# EAGLE design DACBRDV3 (EAGLE 5.07)
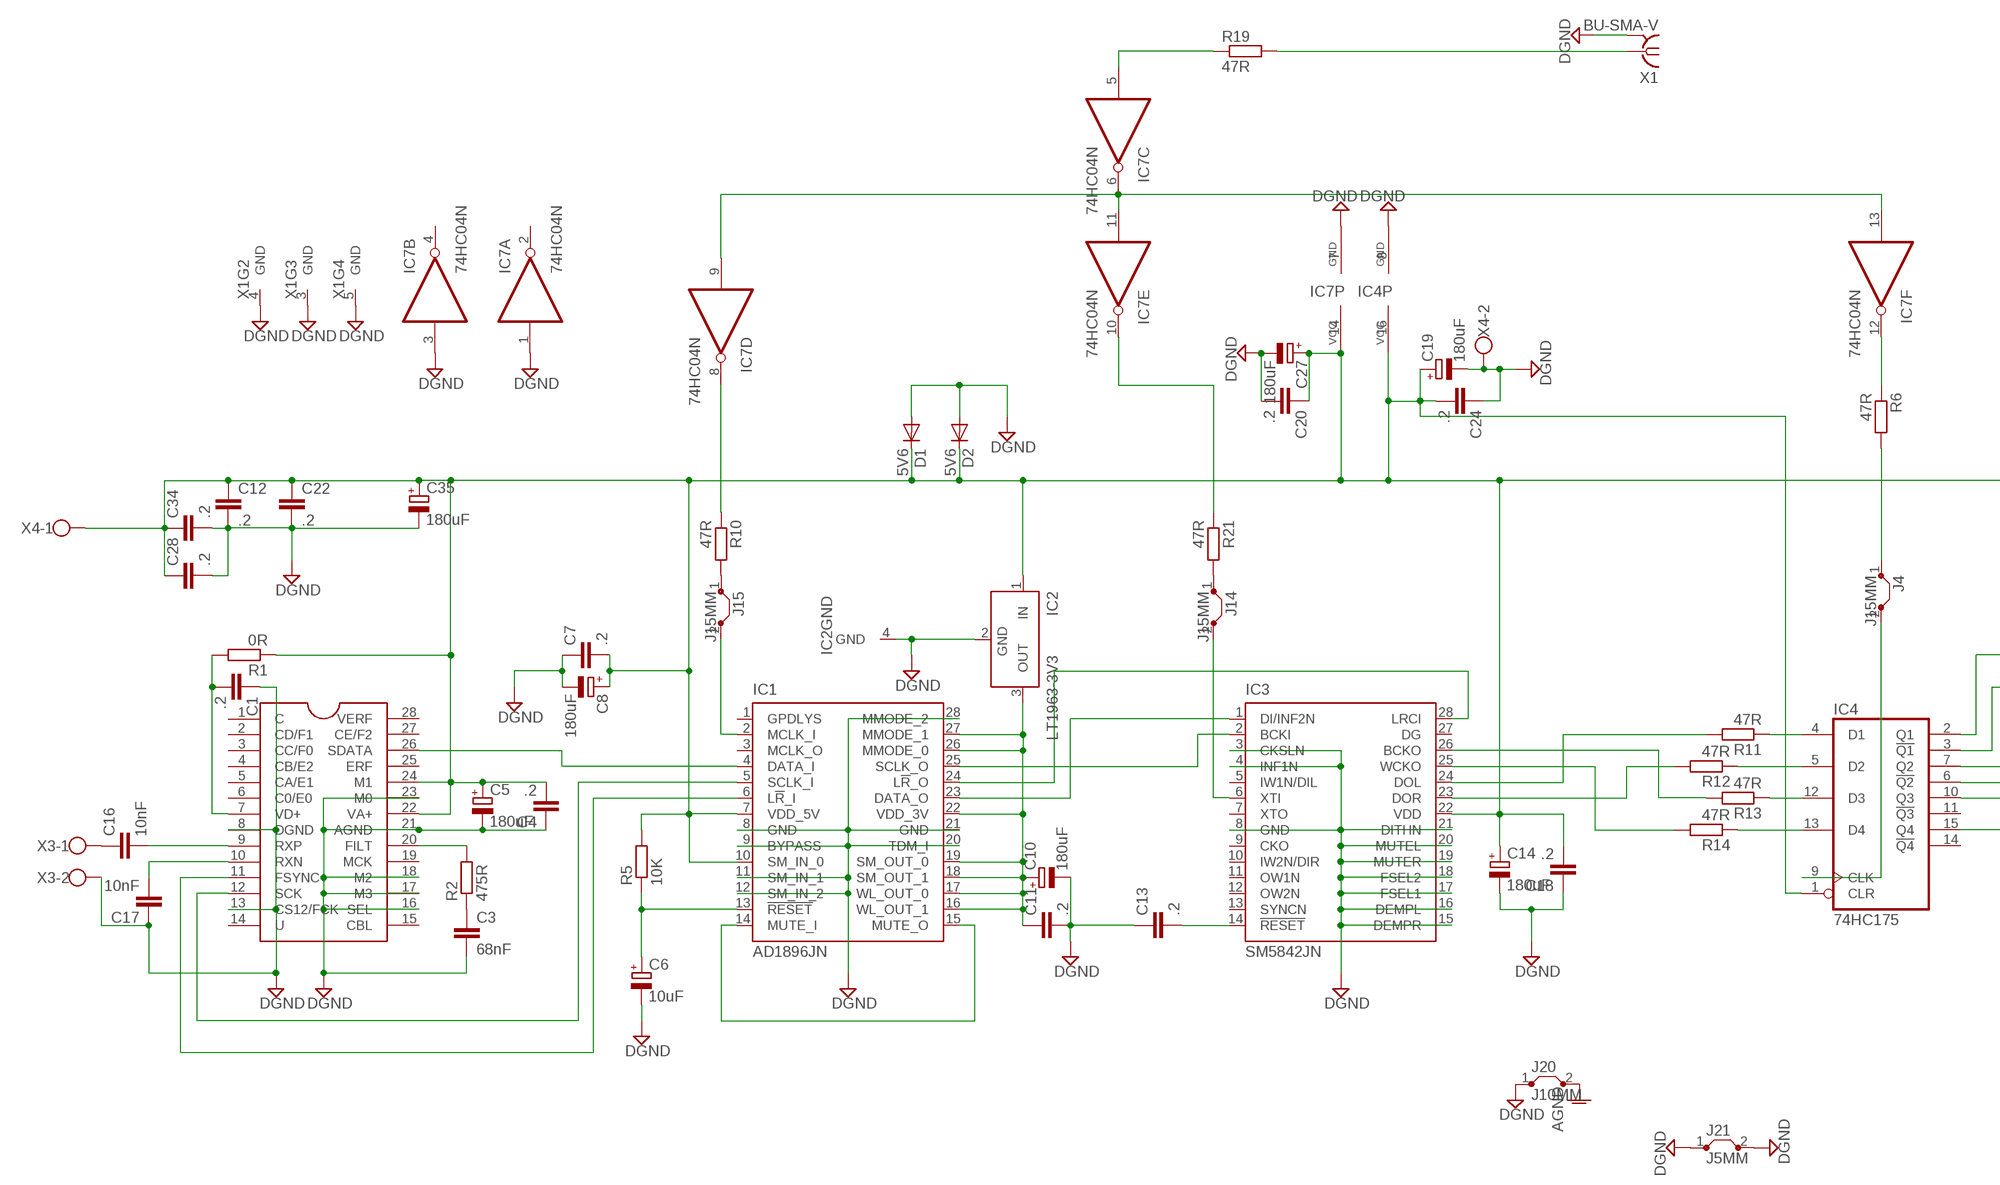
[diagram p0: schematic, sheet 1, part 1 of 2]
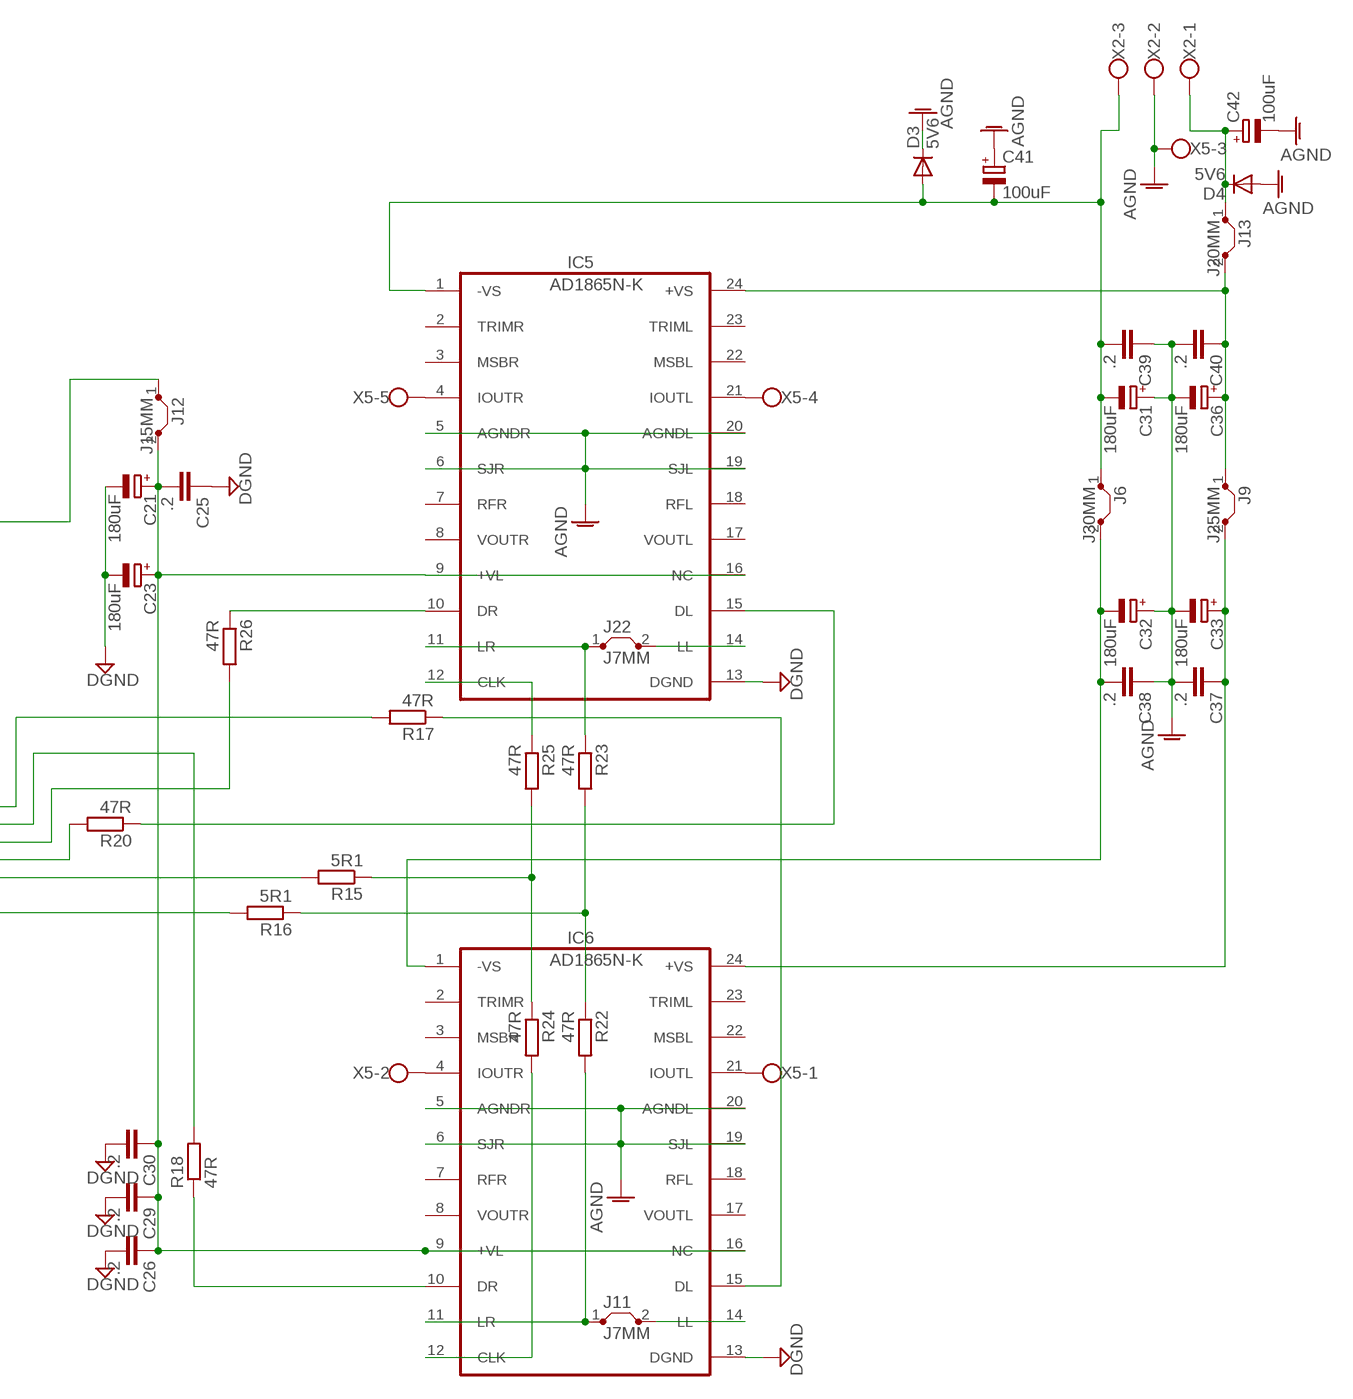
[diagram p1: schematic, sheet 1, part 2 of 2]

## Parts
C1  .2  C-EUC1210K  [C1210K]
C3  68nF  C-EU050-075X075  [C050-075X075]
C4  .2  C-EUC1210K  [C1210K]
C5  180uF  CPOL-EUE3.5-8  [E3,5-8]
C6  10uF  CPOL-EUE3.5-8  [E3,5-8]
C7  .2  C-EUC1210K  [C1210K]
C8  180uF  CPOL-EUE3.5-8  [E3,5-8]
C10  180uF  CPOL-EUE3.5-8  [E3,5-8]
C11  .2  C-EUC1210K  [C1210K]
C12  .2  C-EUC1210K  [C1210K]
C13  .2  C-EUC1210K  [C1210K]
C14  180uF  CPOL-EUE3.5-8  [E3,5-8]
C16  10nF  C-EU050-055X075  [C050-055X075]
C17  10nF  C-EU050-055X075  [C050-055X075]
C18  .2  C-EUC1210K  [C1210K]
C19  180uF  CPOL-EUE3.5-8  [E3,5-8]
C20  .2  C-EUC1210K  [C1210K]
C21  180uF  CPOL-EUE3.5-8  [E3,5-8]
C22  .2  C-EUC1210K  [C1210K]
C23  180uF  CPOL-EUE3.5-8  [E3,5-8]
C24  .2  C-EUC1210K  [C1210K]
C25  .2  C-EUC1210K  [C1210K]
C26  .2  C-EUC1210K  [C1210K]
C27  180uF  CPOL-EUE3.5-8  [E3,5-8]
C28  .2  C-EUC1210K  [C1210K]
C29  .2  C-EUC1210K  [C1210K]
C30  .2  C-EUC1210K  [C1210K]
C31  180uF  CPOL-EUE3.5-8  [E3,5-8]
C32  180uF  CPOL-EUE3.5-8  [E3,5-8]
C33  180uF  CPOL-EUE3.5-8  [E3,5-8]
C34  .2  C-EUC1210K  [C1210K]
C35  180uF  CPOL-EUE3.5-8  [E3,5-8]
C36  180uF  CPOL-EUE3.5-8  [E3,5-8]
C37  .2  C-EUC1210K  [C1210K]
C38  .2  C-EUC1210K  [C1210K]
C39  .2  C-EUC1210K  [C1210K]
C40  .2  C-EUC1210K  [C1210K]
C41  100uF  CPOL-EUE5-10.5  [E5-10,5]
C42  100uF  CPOL-EUE5-10.5  [E5-10,5]
D1  5V6  A114  [DO204-10]
D2  5V6  A114  [DO204-10]
D3  5V6  A114  [DO204-10]
D4  5V6  A114  [DO204-10]
IC1  AD1896JN  [DIL28-6]
IC2  LT1963-3V3  LT1129CST5  [SOT223]
IC3  SM5842JN  [DIL28-6]
IC4  74HC175  74175N  [DIL16]
IC5  AD1865N-K  AD1865  [DIL24-6]
IC6  AD1865N-K  AD1865  [DIL24-6]
IC7  74HC04N  7404N  [DIL14]
J4  J15MM  [15]
J6  J30MM  [30]
J9  J25MM  [25]
J11  J7MM  [07]
J12  J15MM  [15]
J13  J20MM  [20]
J14  J15MM  [15]
J15  J15MM  [15]
J20  J10MM  [10]
J21  J5MM  [05]
J22  J7MM  [07]
R1  0R  R-EU_M5923  [M5923]
R2  475R  R-EU_0204/7  [0204/7]
R5  10K  R-EU_0204/7  [0204/7]
R6  47R  R-EU_0207/12  [0207/12]
R10  47R  R-EU_0204/7  [0204/7]
R11  47R  R-EU_0204/7  [0204/7]
R12  47R  R-EU_0207/10  [0207/10]
R13  47R  R-EU_0204/7  [0204/7]
R14  47R  R-EU_0204/7  [0204/7]
R15  5R1  R-EU_0204/7  [0204/7]
R16  5R1  R-EU_0204/7  [0204/7]
R17  47R  R-EU_0207/10  [0207/10]
R18  47R  R-EU_0207/10  [0207/10]
R19  47R  R-EU_0207/10  [0207/10]
R20  47R  R-EU_0207/12  [0207/12]
R21  47R  R-EU_0204/7  [0204/7]
R22  47R  R-EU_0207/12  [0207/12]
R23  47R  R-EU_0207/15  [0207/15]
R24  47R  R-EU_0207/12  [0207/12]
R25  47R  R-EU_0207/15  [0207/15]
R26  47R  R-EU_0207/12  [0207/12]
U$1  CS8414  CS8414DIP  [DIL28]
X1  BU-SMA-V  [BU-SMA-V]
X2  W237-03P  [W237-133]
X3  W237-02P  [W237-132]
X4  W237-02P  [W237-132]
X5  W237-05P  [W237-5P]

## Nets
AGND: C31.+ C32.+ C33.- C36.- C37.2 C38.1 C39.1 C40.2 C41.+ C42.- D3.C D4.A IC5.5(AGNDR) IC5.6(SJR) IC5.19(SJL) IC5.20(AGNDL) IC6.5(AGNDR) IC6.6(SJR) IC6.19(SJL) IC6.20(AGNDL) J20.2 X2.2 X5.3
DGND: C1.1 C3.2 C4.1 C5.- C6.- C7.1 C8.- C10.- C11.2 C12.2 C13.1 C14.- C17.1 C18.1 C19.- C20.2 C21.- C22.2 C23.- C24.1 C25.1 C26.2 C27.- C28.2 C29.2 C30.2 C34.2 C35.- D1.A D2.A IC1.8(GND) IC1.9(BYPASS) IC1.11(SM_IN_1) IC1.12(SM_IN_2) IC1.20(TDM_I) IC1.21(GND) IC1.28(MMODE_2) IC2.2(GND) IC2.4(GND) IC3.3(CKSLN) IC3.4(INF1N) IC3.8(GND) IC3.15(DEMPR) IC3.16(DEMPL) IC3.17(FSEL1) IC3.18(FSEL2) IC3.19(MUTER) IC3.20(MUTEL) IC3.21(DITHN) IC4.8(GND) IC5.13(DGND) IC6.13(DGND) IC7.1(A:I) IC7.3(B:I) IC7.7(P:GND) J20.1 J21.1 J21.2 U$1.8(DGND) U$1.13(CS12/FCK) U$1.16(SEL) U$1.17(M3) U$1.18(M2) U$1.21(AGND) U$1.23(M0) X1.2(GND) X1.3(GND) X1.4(GND) X1.5(GND) X3.2 X4.2
N$1: R2.2 U$1.20(FILT)
N$2: IC1.14(MUTE_I) IC1.15(MUTE_O)
N$3: C3.1 R2.1
N$5: C1.2 R1.2 U$1.7(VD+)
N$7: C4.2 C5.+ C7.2 C8.+ C12.1 C14.+ C18.2 C19.+ C20.1 C22.1 C24.2 C27.+ C28.1 C34.1 C35.+ D1.C D2.C IC1.7(VDD_5V) IC1.10(SM_IN_0) IC2.1(IN) IC3.22(VDD) IC4.1(CLR) IC4.16(VCC) IC7.14(P:VCC) J12.1 R1.1 R5.2 U$1.22(VA+) U$1.24(M1) X4.1
N$8: C10.+ C11.1 IC1.16(WL_OUT_1) IC1.17(WL_OUT_0) IC1.18(SM_OUT_1) IC1.19(SM_OUT_0) IC1.22(VDD_3V) IC1.26(MMODE_0) IC1.27(MMODE_1) IC2.3(OUT)
N$10: C6.+ IC1.13(!RESET) R5.1
N$12: IC1.2(MCLK_I) J15.2
N$14: IC7.8(D:O) R10.1
N$15: IC7.12(F:O) R6.1
N$17: IC3.6(XTI) J14.2
N$19: IC1.4(DATA_I) U$1.26(SDATA)
N$21: IC1.23(DATA_O) IC3.1(DI/INF2N)
N$22: IC1.25(SCLK_O) IC3.2(BCKI)
N$23: C17.2 U$1.10(RXN)
N$24: C16.2 U$1.9(RXP)
N$25: C16.1 X3.1
N$26: IC1.24(L!R!_O) IC3.28(LRCI)
N$28: IC7.10(E:O) R21.1
N$29: C13.2 IC3.14(!RESET)
N$31: IC3.26(BCKO) R13.2
N$33: IC1.6(L!R!_I) U$1.11(FSYNC)
N$34: IC1.5(SCLK_I) U$1.12(SCK)
N$36: IC3.24(DOL) R11.2
N$37: IC3.23(DOR) R12.2
N$38: IC4.4(D1) R11.1
N$40: IC4.5(D2) R12.1
N$41: IC4.12(D3) R13.1
N$44: IC4.13(D4) R14.1
N$45: IC3.25(WCKO) R14.2
N$47: IC4.10(Q3) R15.2
N$48: IC4.15(Q4) R16.2
N$49: IC4.2(Q1) R17.2
N$50: IC4.3(!Q1) R18.2
N$51: IC5.10(DR) R26.1
N$52: IC4.6(!Q2) R20.2
N$53: IC4.9(CLK) J4.2
N$54: J4.1 R6.2
N$55: IC6.11(LR) J11.1 R22.2
N$56: IC5.11(LR) J22.1 R23.1
N$57: R16.1 R22.1 R23.2
N$58: R15.1 R24.1 R25.2
N$59: IC5.12(CLK) R25.1
N$60: IC6.12(CLK) R24.2
N$61: IC7.6(C:O) IC7.9(D:I) IC7.11(E:I) IC7.13(F:I)
N$62: C21.+ C23.+ C25.2 C26.1 C29.1 C30.1 IC5.9(+VL) IC5.16(NC) IC6.9(+VL) IC6.16(NC) J12.2
N$63: IC5.15(DL) R20.1
N$64: IC6.10(DR) R18.1
N$65: IC4.7(Q2) R26.2
N$66: IC6.15(DL) R17.1
N$67: J15.1 R10.2
N$68: IC6.14(LL) J11.2
N$69: IC7.5(C:I) R19.1
N$70: C32.- C38.2 IC6.1(-VS) J6.2
N$71: IC5.14(LL) J22.2
N$72: J14.1 R21.2
N$73: C33.+ C37.1 IC6.24(+VS) J9.2
N$74: C31.- C39.2 C41.- D3.A IC5.1(-VS) J6.1 X2.3
N$75: C36.+ C40.1 IC5.24(+VS) J9.1 J13.2
N$76: IC5.4(IOUTR) X5.5
N$77: C42.+ D4.C J13.1 X2.1
N$78: IC5.21(IOUTL) X5.4
N$79: IC6.21(IOUTL) X5.1
N$80: IC6.4(IOUTR) X5.2
N$83: R19.2 X1.1
Unconnected: IC1.1(GPDLYS) IC1.3(MCLK_O) IC3.5(IW1N/DIL) IC3.7(XTO) IC3.9(CKO) IC3.10(IW2N/DIR) IC3.11(OW1N) IC3.12(OW2N) IC3.13(SYNCN) IC3.27(DG) IC4.11(!Q3) IC4.14(!Q4) IC5.2(TRIMR) IC5.3(MSBR) IC5.7(RFR) IC5.8(VOUTR) IC5.17(VOUTL) IC5.18(RFL) IC5.22(MSBL) IC5.23(TRIML) IC6.2(TRIMR) IC6.3(MSBR) IC6.7(RFR) IC6.8(VOUTR) IC6.17(VOUTL) IC6.18(RFL) IC6.22(MSBL) IC6.23(TRIML) IC7.2(A:O) IC7.4(B:O) U$1.1(C) U$1.2(CD/F1) U$1.3(CC/F0) U$1.4(CB/E2) U$1.5(CA/E1) U$1.6(C0/E0) U$1.14(U) U$1.15(CBL) U$1.19(MCK) U$1.25(ERF) U$1.27(CE/F2) U$1.28(VERF)

## Library data of the parts
C1 C3 C4 C7 C11-C13 C16-C18 C20 C22 C24-C26 C28-C30 C34 C37-C40 = resistor:C-EU: CAPACITOR, European symbol
C5 C6 C8 C10 C14 C19 C21 C23 C27 C31-C33 C35 C36 C41 C42 = resistor:CPOL-EU: POLARIZED CAPACITOR, European symbol
D1-D4 = diode:A114: DIODE germanium
IC1 = analog-devices:AD1896: Stereo Asynchronous Sample Rate Converter Auto generated by make-symbol-device-package-bsdl.ulp Rev. 33 Source: http://www.analog.com/static/imported-files/data_sheets/AD1896.pdf
IC2 = linear-technology:LT1129CST5: VOLTAGE REGULATOR with shutdown
IC3 = analog-devices:SM5842: High-Class Audio Multi-function Digital Filter Source: http://www.dddac.de/files/SM5842.pdf
IC4 = 74xx-us:74*175: Qadruple D type FLIP FLOP, clear
IC5 IC6 = pavouk:AD1865: Complete Dual 18-Bit 16xFS Audio DAC
IC7 = 74xx-us:74*04: Hex INVERTER
J4 J6 J9 J11-J15 J20-J22 = jumper:J: Bridge
R1 R2 R5 R6 R10-R26 = resistor:R-EU_: RESISTOR, European symbol
U$1 = cirrus-dar:CS8414: 24bit 96kHz Digital Audio Receiver
X1 = con-coax:BU-SMA-V: FEMALE SMA CONNECTOR Radiall distributor RS 112-3794
X2 = con-wago-508:W237-03P: WAGO SREW CLAMP
X3 X4 = con-wago-508:W237-02P: WAGO SREW CLAMP
X5 = con-wago-508:W237-05P: WAGO SREW CLAMP

## Board
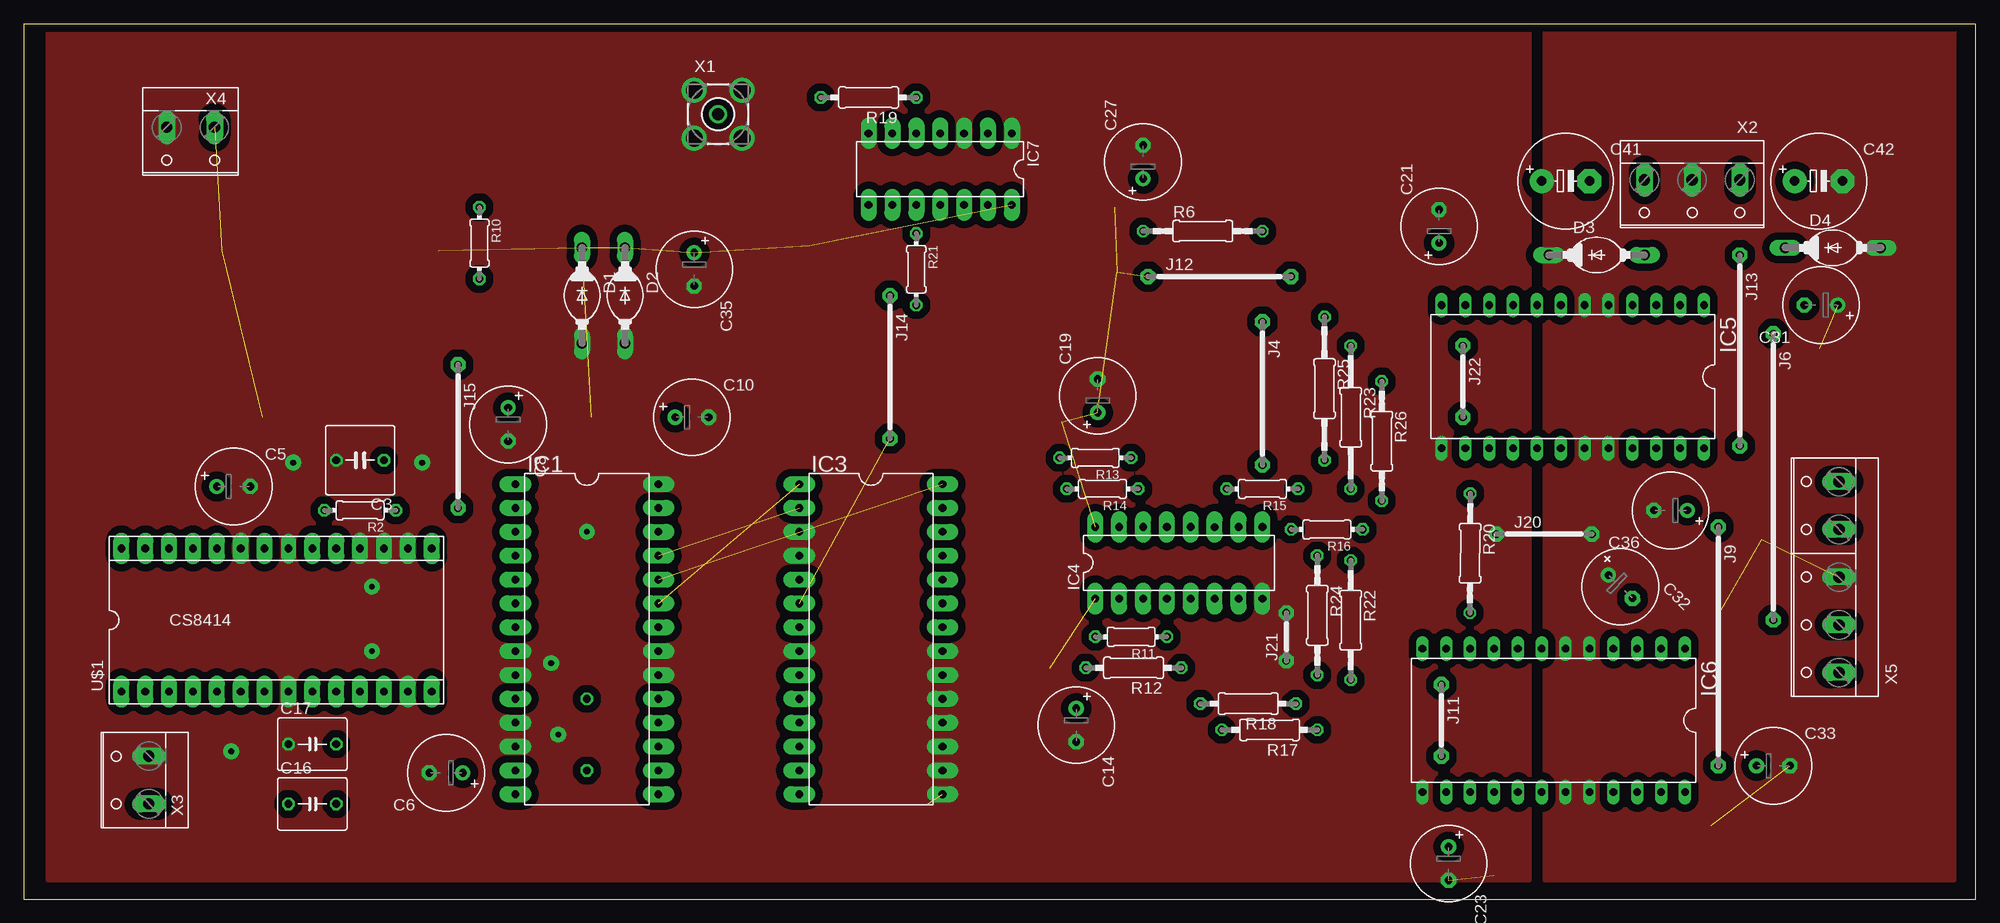
[diagram p2: board, top side]
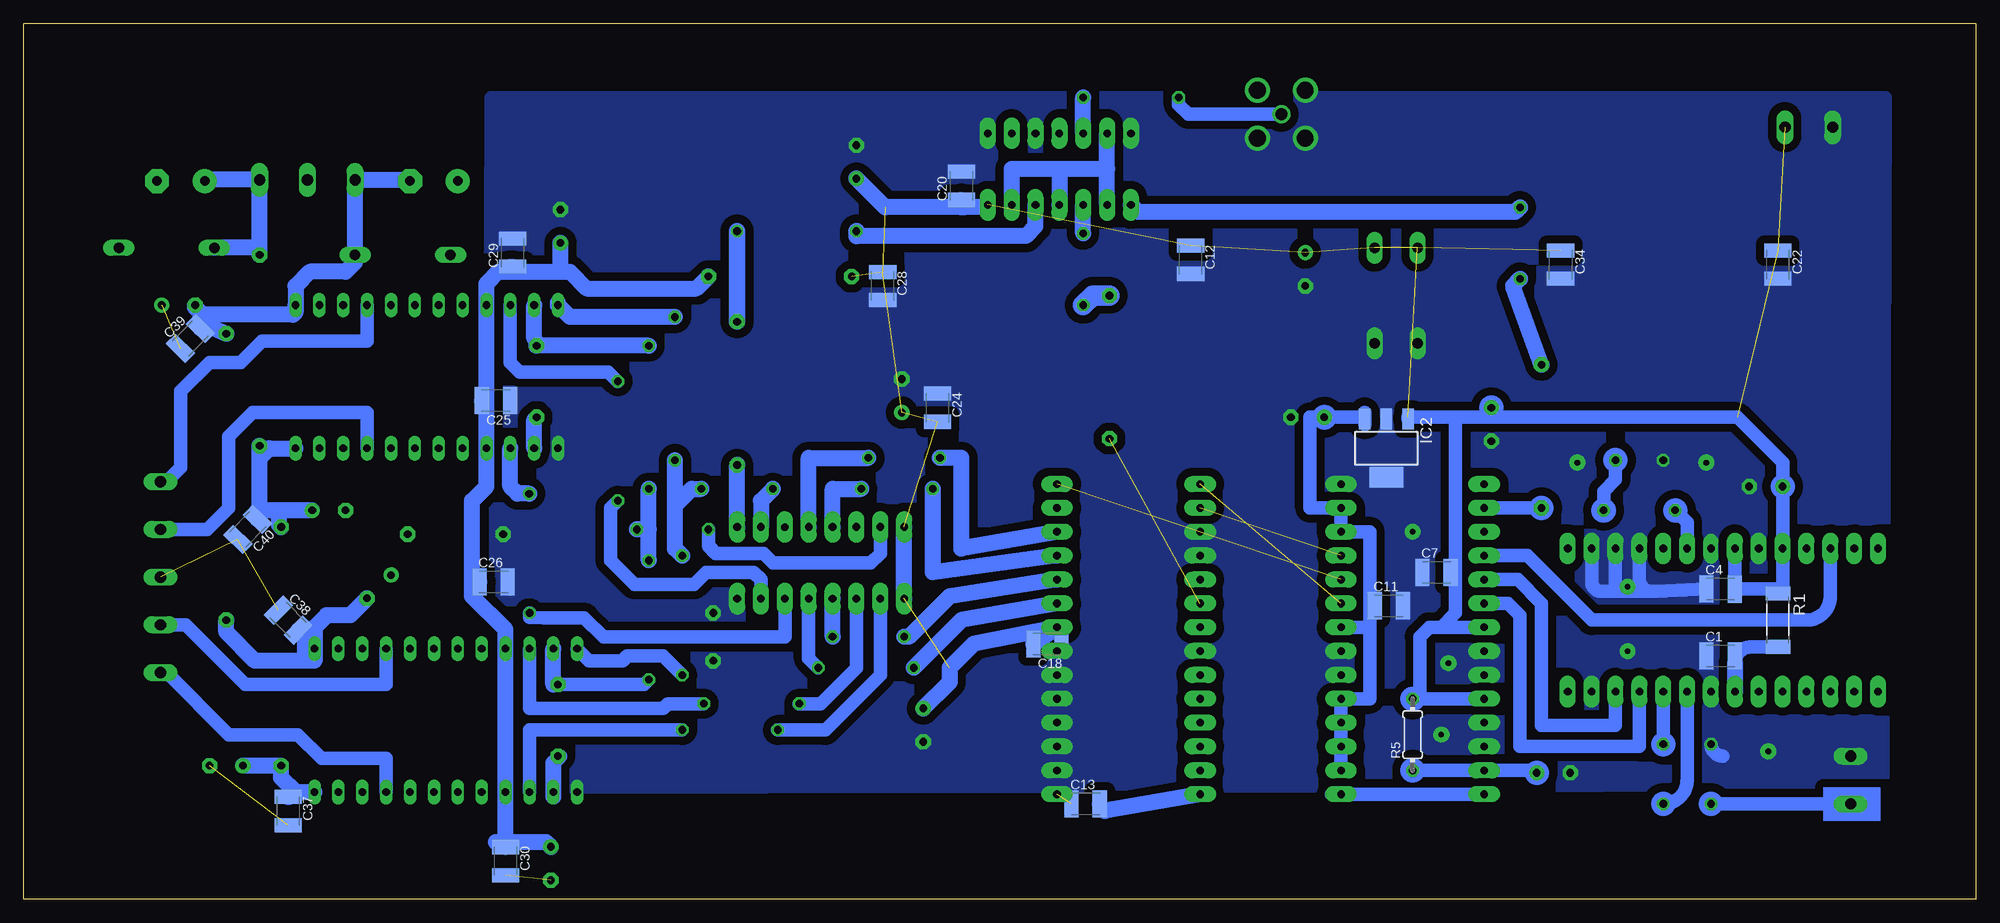
[diagram p3: board, bottom side, seen from below]

Size 207.75 x 93.22 mm. Coordinates in mm from the lower left corner, seen from the top.
Outline: 207.75,93.22 207.75,0 0,0 0,93.22 207.75,93.22
Copper layers (1*16): Top 0.035mm / dielectric 1.5mm / Bottom 0.035mm
Design rules "default *": minimum track width 10mil, minimum drill 24mil, track to track 8mil, track to pad 8mil, pad to pad 8mil, via to via 8mil, smd to smd 8mil, copper to edge 30mil, drill to drill 8mil, minimum pad ring 10mil, minimum via ring 8mil, stop-mask expansion 4mil, vias tented up to drill 0mil, thermal gap 10mil

### Footprints (pad centres in the part's own frame; a part is rotated, then mirrored left to right if it is on the bottom)
C1210K = smd 1.5 x 2.9: 1 -1.5,0; 2 1.5,0
C050-075X075 = drill 0.813 octagon: 1 -2.54,0; 2 2.54,0
E3,5-8 = drill 0.813 pad 1.6 round: + -1.778,0 | drill 0.813 pad 1.6 octagon: - 1.778,0
C050-055X075 = drill 0.813 octagon: 1 -2.54,0; 2 2.54,0
E5-10,5 = drill 1.016 pad 2.54 round: + -2.54,0 | drill 1.016 pad 2.54 octagon: - 2.54,0
DO204-10 = drill 1.118 long: A 5.08,0; C -5.08,0
DIL28-6 = drill 0.813 pad 1.676 long: 1 -16.51,-7.62; 2 -13.97,-7.62; 3 -11.43,-7.62; 4 -8.89,-7.62; 5 -6.35,-7.62; 6 -3.81,-7.62; 7 -1.27,-7.62; 8 1.27,-7.62; 9 3.81,-7.62; 10 6.35,-7.62; 11 8.89,-7.62; 12 11.43,-7.62; 13 13.97,-7.62; 14 16.51,-7.62; 15 16.51,7.62; 16 13.97,7.62; 17 11.43,7.62; 18 8.89,7.62; 19 6.35,7.62; 20 3.81,7.62; 21 1.27,7.62; 22 -1.27,7.62; 23 -3.81,7.62; 24 -6.35,7.62; 25 -8.89,7.62; 26 -11.43,7.62; 27 -13.97,7.62; 28 -16.51,7.62
SOT223 = smd 1.219 x 2.235: 1 -2.311,-3.099; 2 0,-3.099; 3 2.311,-3.099 | smd 3.6 x 2.2: 4 0,3.099
DIL16 = drill 0.813 pad 1.676 long: 1 -8.89,-3.81; 2 -6.35,-3.81; 3 -3.81,-3.81; 4 -1.27,-3.81; 5 1.27,-3.81; 6 3.81,-3.81; 7 6.35,-3.81; 8 8.89,-3.81; 9 8.89,3.81; 10 6.35,3.81; 12 1.27,3.81; 13 -1.27,3.81; 14 -3.81,3.81; 15 -6.35,3.81; 16 -8.89,3.81 | drill 0.8 pad 1.676 long: 11 3.81,3.81
DIL24-6 = drill 0.813 long: 1 -13.97,-7.62; 2 -11.43,-7.62; 3 -8.89,-7.62; 4 -6.35,-7.62; 5 -3.81,-7.62; 6 -1.27,-7.62; 7 1.27,-7.62; 8 3.81,-7.62; 9 6.35,-7.62; 10 8.89,-7.62; 11 11.43,-7.62; 12 13.97,-7.62; 13 13.97,7.62; 14 11.43,7.62; 15 8.89,7.62; 16 6.35,7.62; 17 3.81,7.62; 18 1.27,7.62; 19 -1.27,7.62; 20 -3.81,7.62; 21 -6.35,7.62; 22 -8.89,7.62; 23 -11.43,7.62; 24 -13.97,7.62
DIL14 = drill 0.813 pad 1.676 long: 1 -7.62,-3.81; 2 -5.08,-3.81; 3 -2.54,-3.81; 4 0,-3.81; 5 2.54,-3.81; 6 5.08,-3.81; 7 7.62,-3.81; 8 7.62,3.81; 9 5.08,3.81; 10 2.54,3.81; 11 0,3.81; 12 -2.54,3.81; 13 -5.08,3.81; 14 -7.62,3.81
15 = drill 0.813 pad 1.6 octagon: 1 -7.62,0; 2 7.62,0
30 = drill 0.813 pad 1.6 octagon: 1 -15.24,0; 2 15.24,0
25 = drill 0.813 pad 1.6 octagon: 1 -12.7,0; 2 12.7,0
07 = drill 0.813 pad 1.6 octagon: 1 -3.81,0; 2 3.81,0
20 = drill 0.813 pad 1.6 octagon: 1 -10.16,0; 2 10.16,0
10 = drill 0.813 pad 1.6 octagon: 1 -5.08,0; 2 5.08,0
05 = drill 0.813 pad 1.6 octagon: 1 -2.54,0; 2 2.54,0
M5923 = smd 1.5 x 2.6: 1 -2.85,0; 2 2.85,0
0204/7 = drill 0.813 octagon: 1 -3.81,0; 2 3.81,0
0207/12 = drill 0.813 octagon: 1 -6.35,0; 2 6.35,0
0207/10 = drill 0.813 octagon: 1 -5.08,0; 2 5.08,0
0207/15 = drill 0.813 octagon: 1 -7.62,0; 2 7.62,0
DIL28 = drill 0.813 pad 1.676 long: 1 -16.51,-7.62; 2 -13.97,-7.62; 3 -11.43,-7.62; 4 -8.89,-7.62; 5 -6.35,-7.62; 6 -3.81,-7.62; 7 -1.27,-7.62; 8 1.27,-7.62; 9 3.81,-7.62; 10 6.35,-7.62; 11 8.89,-7.62; 12 11.43,-7.62; 13 13.97,-7.62; 14 16.51,-7.62; 15 16.51,7.62; 16 13.97,7.62; 17 11.43,7.62; 18 8.89,7.62; 19 6.35,7.62; 20 3.81,7.62; 22 -1.27,7.62; 23 -3.81,7.62; 24 -6.35,7.62; 25 -8.89,7.62; 26 -11.43,7.62; 27 -13.97,7.62; 28 -16.51,7.62 | drill 0.813 pad 1.6 long: 21 1.27,7.62
BU-SMA-V = drill 1.27 round: 1 0,0 | drill 1.778 round: 2 -2.55,2.55; 3 2.55,2.55; 4 2.55,-2.55; 5 -2.55,-2.55
W237-133 = drill 1.194 long: 1 -5.08,-0.635; 2 0,-0.635; 3 5.08,-0.635
W237-132 = drill 1.194 long: 1 -2.54,-0.635; 2 2.54,-0.635
W237-5P = drill 1.194 long: 1 -10.16,-0.635; 2 -5.08,-0.635; 3 0,-0.635; 4 5.08,-0.635; 5 10.16,-0.635

### Placement (x,y rotation side)
C1  27.18,25.91 0 bottom
C3  35.81,46.74 180 top
C4  27.18,33.02 359.9 bottom
C5  22.35,43.94 0 top
C6  44.96,13.46 180 top
C7  57.4,34.8 0 bottom
C8  51.56,50.55 270 top
C10  71.12,51.31 0 top
C11  62.48,31.24 0 bottom
C12  83.57,68.07 270 bottom
C13  94.74,10.16 0 bottom
C14  112.01,18.54 270 top
C16  30.73,10.16 0 top
C17  30.73,16.51 0 top
C18  98.81,27.18 180 bottom
C19  114.3,53.59 90 top
C20  107.95,75.95 90 bottom
C21  150.62,71.63 90 top
C22  21.08,67.56 270 bottom
C23  151.64,3.81 270 top
C24  110.49,52.32 270 bottom
C25  157.48,53.09 180 bottom
C26  157.73,33.78 359.9 bottom
C27  119.13,78.49 90 top
C28  116.33,65.28 270 bottom
C29  155.7,68.83 90 bottom
C30  156.46,4.06 270 bottom
C31  191.26,63.25 180.2 top
C32  169.93,33.27 316.1 top
C33  186.18,14.22 0 top
C34  44.2,67.56 270 bottom
C35  71.37,67.06 270 top
C36  175.26,41.4 180 top
C37  179.58,9.4 270 bottom
C38  179.58,29.72 315 bottom
C39  189.99,59.69 44.9 bottom
C40  183.9,39.37 226 bottom
C41  164.08,76.45 0 top
C42  191.01,76.45 0 top
D1  59.44,64.26 270 top
D2  64.01,64.26 270 top
D3  167.39,68.58 0 top
D4  192.53,69.34 0 top
IC1  59.94,27.69 270 top
IC2  62.74,48.01 180 bottom
IC3  90.17,27.69 270 top
IC4  122.94,35.81 0 top
IC5  164.85,55.63 180 top
IC6  162.81,19.05 180 top
IC7  97.54,77.72 180 top
J4  131.83,53.85 270 top
J6  186.18,44.96 270 top
J9  180.34,26.92 270 top
J11  150.88,19.05 270 top
J12  127.25,66.29 0 top
J13  182.63,58.42 270 top
J14  92.2,56.64 270 top
J15  46.23,49.28 270 top
J20  161.8,38.86 0 top
J21  134.37,27.94 90 top
J22  153.16,55.12 270 top
R1  21.08,29.72 270 bottom
R2  35.81,41.4 180 top
R5  59.94,17.53 90 bottom
R6  125.48,71.12 0 top
R10  48.51,69.85 270 top
R11  117.86,27.94 180 top
R12  118.11,24.64 180 top
R13  114.05,46.99 180 top
R14  114.81,43.69 180 top
R15  131.83,43.69 180 top
R16  138.68,39.37 180 top
R17  132.59,18.03 180 top
R18  130.3,20.83 180 top
R19  89.92,85.34 180 top
R20  153.92,36.83 269.8 top
R21  95,67.06 270 top
R22  141.22,29.72 270 top
R23  141.22,51.31 270 top
R24  137.67,30.23 270 top
R25  138.43,54.36 270 top
R26  144.53,48.77 270 top
U$1  26.92,29.72 0 top
X1  73.91,83.57 0 top
X2  177.55,75.95 180 top
X3  12.7,12.7 90 top
X4  17.78,81.53 180 top
X5  192.53,34.29 90 top

### Tracks (layer width: path | path; a pad name or v marks a point on that pad's centre or on a via)
AGND  (4 unrouted)
  pour Top (isolate 0.813, no thermals): 161.8,92.71 161.8,2.03 205.49,2.03 205.49,92.46
DGND  (via drill 0.6 pad 1.68)  (2 unrouted)
  Bottom 1.422: 26.92,15.24 arc90 C17.1 | C4.1 34.04,32.77 | 34.04,32.77 34.55,32.77 arc90 35.81,34.04 U$1.18 | U$1.17 38.35,33.27 arc-90 37.85,32.77 | 37.85,32.77 34.04,32.77 arc-90 34.04,32.77 | U$1.16 40.89,33.78 arc-90 39.88,32.77 37.85,32.77
  other vias: 37.08,33.27 37.08,26.42 22.1,15.75 56.13,25.15 56.9,17.53 59.94,39.12 28.7,46.48 42.42,46.48
  pour Top (isolate 0.813, no thermals): 2.54,92.2 2.54,2.03 160.27,2.03 160.27,92.2
  pour Bottom (isolate 0.889, no thermals): 9.65,85.34 9.91,12.19 158.24,11.94 157.99,85.34
N$1
  Bottom 1.422: R2.2 30.73,40.13 U$1.20
N$2
  Bottom 1.422: IC1.14 IC1.15 68.58,11.18
N$3
  Bottom 1.422: C3.1 38.35,44.7 39.62,43.43 R2.1
N$5
  Bottom 1.422: R1.2 23.93,26.87 arc-90 25.65,25.15 25.65,26.16 arc-90 25.65,26.42 C1.2
  Bottom 1.676: 25.65,25.15 U$1.7
N$7  (14 unrouted)
  Bottom 1.422: 21.08,33.02 20.57,33.02 U$1.24 C5.+ 20.57,46.48 25.4,51.31 51.56,51.31 | 21.08,33.02 C4.2 25.65,33.02 U$1.22 | R1.1 21.08,33.02 | 59.18,21.34 IC1.10 | 56.9,28.96 IC1.7 | 55.37,51.31 55.37,34.8 | 55.37,51.31 60.43,51.31 IC2.1 | 55.37,34.8 C7.2 | 51.56,51.31 55.37,51.31 | 51.56,51.31 C8.+ | 55.37,34.8 55.37,30.48 56.9,28.96 | 56.9,28.96 58.17,28.96 59.18,27.94 59.18,21.34 | 59.18,21.34 R5.2
  Bottom 1.676: IC4.1 IC4.16 | 107.95,73.66 C20.1 107.7,74.19 107.7,73.66 | IC7.14 105.41,73.66 107.7,73.66 | 107.7,73.66 107.95,73.66 | 107.95,73.66 116.08,73.66 C27.+ | C18.2 IC3.22 106.68,27.18 109.22,24.64 109.22,23.11 C14.+
N$8
  Bottom 1.422: IC1.16 IC1.17 IC1.18 IC1.19 64.52,21.34 64.52,28.96 | 64.52,28.96 IC1.22 | 64.52,31.47 64.52,39.12 IC1.26 IC1.27 70.87,41.66 70.87,51.31 C10.+ 65.02,51.31 | 65.02,51.31 65.02,50.55 | 65.02,51.31 65.02,51.82 65.05,51.82 IC2.3 | 64.52,31.47 C11.1 | 64.52,28.96 64.52,29.21 64.52,31.47
N$10
  Bottom 1.422: C6.+ 46.99,13.72 IC1.13 59.69,13.72 R5.1
N$12
  Bottom 1.422: J15.2 IC1.2
N$14
  Bottom 1.676: R10.1 49.02,73.15 89.15,73.15 IC7.8
N$15
  Bottom 1.676: IC7.12 100.08,71.63 101.09,70.61 119.13,70.61
  Bottom 1.778: 119.13,70.61 R6.1
N$17  (1 unrouted)
N$19
  Bottom 1.422: U$1.26 15.49,32.26 arc90 18.03,29.72 40.89,29.72 47.75,36.58 IC1.4
N$21  (1 unrouted)
N$22  (1 unrouted)
N$23
  Bottom 1.422: C17.2 U$1.10
N$24
  Bottom 1.422: U$1.9 30.73,12.7 arc90 C16.2
N$25
  Bottom 1.422: X3.1 C16.1
N$26  (1 unrouted)
N$28
  Bottom 1.676: R21.1 IC7.10
N$29
  Bottom 1.676: IC3.14 92.71,9.4 92.96,9.65 C13.2
N$31
  Bottom 1.676: IC3.26 107.95,37.34 107.95,46.99 R13.2
N$33
  Bottom 1.422: U$1.11 35.81,16.26 48.51,16.26 48.51,30.23 49.78,31.5 IC1.6
N$34
  Bottom 1.422: U$1.12 38.35,18.54 46.23,18.54 46.23,31.5 48.77,34.04 IC1.5
N$36
  Bottom 1.676: R11.2 113.54,27.94 109.22,32.26 IC3.24
N$37
  Bottom 1.676: IC3.23 107.95,29.72 R12.2
N$38
  Bottom 1.676: R11.1 IC4.4 121.67,32.77
N$40
  Bottom 1.422: IC4.5 124.21,25.65 R12.1
N$41
  Bottom 1.676: R13.1 124.21,46.99 IC4.12
N$44
  Bottom 1.676: R14.1 121.67,43.69 IC4.13
N$45
  Bottom 1.676: IC3.25 111,34.8 R14.2
N$47
  Bottom 1.676: R15.2 129.29,42.42 IC4.10
N$48
  Bottom 1.422: R16.2 134.87,37.59 134.11,36.83 129.03,36.83 128.02,35.81 117.6,35.81 116.59,36.83 IC4.15
N$49
  Bottom 1.422: IC4.2 116.59,23.88 122.43,18.03 R17.2
N$50
  Bottom 1.422: IC4.3 119.13,24.64 122.94,20.83 R18.2
N$51
  Bottom 1.422: R26.1 145.54,56.13 154.94,56.13 155.96,57.15 IC5.10
N$52
  Bottom 1.422: IC4.6 126.75,27.94 146.05,27.94 148.08,29.97 152.4,29.97 153.92,29.99 R20.2
N$53
  Bottom 1.676: IC4.9 J4.2
N$54
  Bottom 1.778: J4.1 R6.2
N$55
  Bottom 1.422: R22.2 141.73,22.86 J11.1 151.38,22.86
  Bottom 1.676: 151.38,22.86 IC6.11
N$56
  Bottom 1.422: J22.1 153.42,59.69
  Bottom 1.676: 153.42,59.69 IC5.11 | R23.1 J22.1
N$57
  Bottom 1.676: R22.1 141.22,39.37 | 141.22,39.37 R23.2 | 141.22,39.37 R16.1
N$58
  Bottom 1.676: R24.1 138.43,37.34 138.43,41.66 138.43,41.91 | 138.43,41.91 R25.2 | R15.1 136.65,43.69 138.43,41.91
N$59
  Bottom 1.676: 150.88,63.5 IC5.12 149.61,61.98 R25.1
N$60
  Bottom 1.422: R24.2 139.7,25.91 143.51,25.91 144.02,25.4 147.57,25.4 IC6.12
N$61
  Bottom 1.676: IC7.9 92.46,77.72 | IC7.13 102.62,77.72 97.54,77.72 | 92.46,77.72 97.54,77.72 | 97.54,77.72 IC7.11 | 92.46,77.72 IC7.6
N$62
  Bottom 1.676: 158.5,53.09 IC5.16 158.5,43.94 160.02,42.42 160.02,33.78 | 158.5,53.09 IC5.9 | IC5.9 | J12.2 136.14,65.02 147.83,65.02 149.61,66.8 150.62,66.8 | 155.96,66.8 157.23,66.8 158.5,65.53 IC5.9 | 155.96,66.8 150.62,66.8 | 150.62,66.8 C21.+ | 158.5,53.09 C25.2 | C29.1 155.96,67.33 155.96,66.8 | 160.02,33.78 160.02,32.26 156.46,28.7 IC6.9 IC6.16 156.46,6.1 | C26.1 160.02,33.78 | C23.+ 152.15,6.1 156.46,6.1 | 156.46,6.1 157.48,6.1 | 156.46,6.1 C30.1
N$63
  Bottom 1.676: R20.1 155.19,43.18 155.96,43.94 IC5.15
N$64
  Bottom 1.422: R18.1 139.19,20.83 139.7,20.32 153.92,20.32 IC6.10
N$65
  Bottom 1.422: IC4.7 129.29,34.04 130.05,34.8 135.13,34.8 136.4,33.53 142.75,33.53 145.29,36.07 145.29,41.66 R26.2
N$66
  Bottom 1.422: R17.1 153.92,18.03 IC6.15
N$67
  Bottom 1.676: R10.2 49.28,65.28 J15.1
N$68
  Bottom 1.422: 151.38,14.48 150.62,15.24 J11.2
  Bottom 1.676: 151.38,14.48 IC6.14 151.38,10.92
N$69
  Bottom 1.676: IC7.5 R19.1
N$70
  Bottom 1.676: J6.2 186.18,28.45 183.13,25.4 177.8,25.4 | 176.78,27.69 176.78,28.96 175.51,30.23 172.97,30.23 171.96,31.24 C32.- | 176.78,27.69 IC6.1 176.78,25.4 177.8,25.4 | 176.78,27.69 177.55,27.69 | C38.2 177.8,27.94 177.8,25.4
N$71
  Bottom 1.422: 153.42,51.05 J22.2
  Bottom 1.676: IC5.14 153.42,51.05
N$72
  Bottom 2.184: J14.1 93.98,64.26 R21.2
N$73
  Bottom 1.676: IC6.24 178.31,11.43 178.82,11.43 | 178.82,11.43 180.34,12.95 J9.2 C33.+ | C37.1 179.58,10.92 179.07,11.43 178.82,11.43
N$74
  Bottom 1.676: C41.- 166.75,76.58 X2.3 D3.A 172.47,67.82 173.48,66.8 177.29,66.8 178.82,65.28 IC5.1 178.82,62.48 179.07,62.23 188.72,62.23 188.98,62.48 | 188.98,62.48 189.48,62.99 C31.- | 188.47,61.21 J6.1 | 188.47,61.21 C39.2 | 188.47,61.21 188.98,61.72 188.98,62.48
N$75
  Bottom 1.676: C36.+ 180.59,41.4 | 180.59,41.4 182.63,41.4 | 182.63,41.4 182.88,41.4 182.63,41.66 J13.2 182.63,46.99 181.61,48.01 IC5.24 | J9.1 180.59,39.88 180.59,41.4 | C40.1 182.63,40.68 182.63,41.4
N$76
  Bottom 1.422: X5.5 192.53,44.45 191.01,45.97 191.01,54.1 187.96,57.15 184.66,57.15 182.37,59.44 171.2,59.44 IC5.4
N$77
  Bottom 1.676: J13.1 182.63,69.34 | 182.63,69.34 X2.1 188.34,76.58 C42.+ | 182.63,69.34 D4.C
N$78
  Bottom 1.422: IC5.21 171.2,51.82 183.39,51.82 185.93,49.28 185.93,41.66 188.21,39.37 X5.4
N$79
  Bottom 1.422: X5.1 192.53,24.13 185.93,17.53 178.56,17.53 176.02,14.99 169.16,14.99 IC6.21
N$80
  Bottom 1.422: IC6.4 169.16,22.86 184.15,22.86 190.5,29.21 X5.2
N$83
  Bottom 1.422: X1.1 83.82,83.57 84.84,84.58 R19.2
(copper drawn outside any net)
  shapes: Bottom area x2, Bottom circle x13